# EAGLE design Crumb_Adapter_V1.2 (EAGLE 6.2)
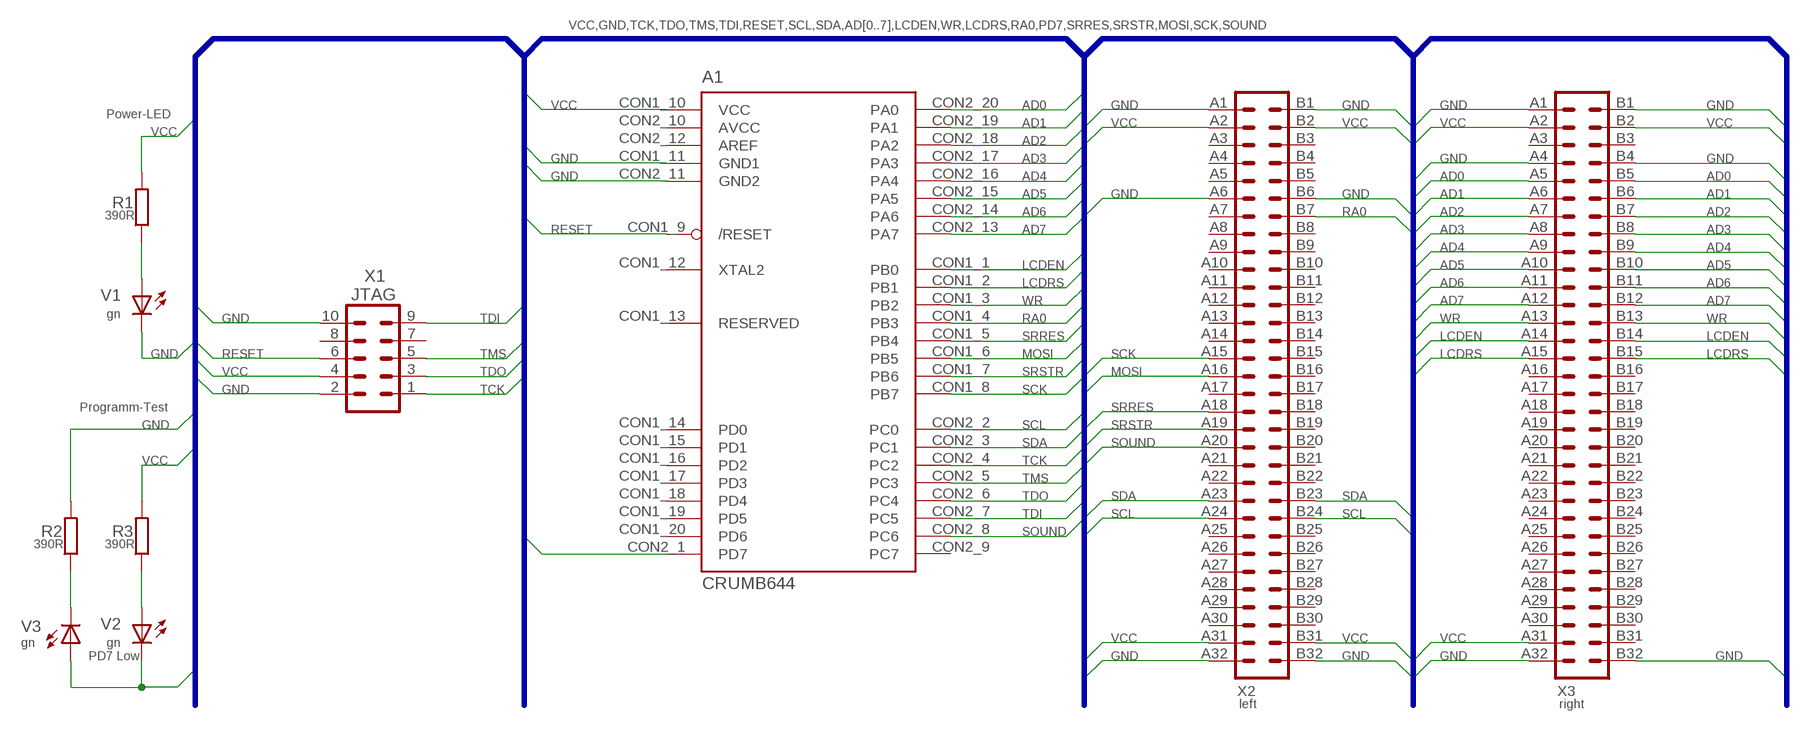
[diagram p0: schematic, sheet 1]

## Parts
A1  CRUMB644  [CRUMB644]
R1  390R  R-EU_VM1206  [M1206]
R2  390R  R-EU_VM1206  [M1206]
R3  390R  R-EU_VM1206  [M1206]
V1  gn  LEDCHIPLED_1206  [CHIPLED_1206]
V2  gn  LEDCHIPLED_1206  [CHIPLED_1206]
V3  gn  LEDCHIPLED_1206  [CHIPLED_1206]
X1  JTAG  MA05-2  [MA05-2]
X2  left  MAB64  [MAB32-2]
X3  right  MAB64  [MAB32-2]

## Nets
AD0: A1.CON2_20(PA0) X3.A5 X3.B5
AD1: A1.CON2_19(PA1) X3.A6 X3.B6
AD2: A1.CON2_18(PA2) X3.A7 X3.B7
AD3: A1.CON2_17(PA3) X3.A8 X3.B8
AD4: A1.CON2_16(PA4) X3.A9 X3.B9
AD5: A1.CON2_15(PA5) X3.A10 X3.B10
AD6: A1.CON2_14(PA6) X3.A11 X3.B11
AD7: A1.CON2_13(PA7) X3.A12 X3.B12
GND: A1.CON1_11(GND1) A1.CON2_11(GND2) R2.2 V1.C X1.2 X1.10 X2.A1 X2.A6 X2.A32 X2.B1 X2.B6 X2.B32 X3.A1 X3.A4 X3.A32 X3.B1 X3.B4 X3.B32
LCDEN: A1.CON1_1(PB0) X3.A14 X3.B14
LCDRS: A1.CON1_2(PB1) X3.A15 X3.B15
MOSI: A1.CON1_6(PB5) X2.A16
N$1: R1.1 V1.A
N$2: R3.1 V2.A
N$3: R2.1 V3.C
PD7: A1.CON2_1(PD7) V2.C V3.A
RA0: A1.CON1_4(PB3) X2.B7
RESET: A1.CON1_9(/RESET) X1.6
SCK: A1.CON1_8(PB7) X2.A15
SCL: A1.CON2_2(PC0) X2.A24 X2.B24
SDA: A1.CON2_3(PC1) X2.A23 X2.B23
SOUND: A1.CON2_8(PC6) X2.A20
SRRES: A1.CON1_5(PB4) X2.A18
SRSTR: A1.CON1_7(PB6) X2.A19
TCK: A1.CON2_4(PC2) X1.1
TDI: A1.CON2_7(PC5) X1.9
TDO: A1.CON2_6(PC4) X1.3
TMS: A1.CON2_5(PC3) X1.5
VCC: A1.CON1_10(VCC) R1.2 R3.2 X1.4 X2.A2 X2.A31 X2.B2 X2.B31 X3.A2 X3.A31 X3.B2
WR: A1.CON1_3(PB2) X3.A13 X3.B13
Unconnected: A1.CON1_12(XTAL2) A1.CON1_13(RESERVED) A1.CON1_14(PD0) A1.CON1_15(PD1) A1.CON1_16(PD2) A1.CON1_17(PD3) A1.CON1_18(PD4) A1.CON1_19(PD5) A1.CON1_20(PD6) A1.CON2_9(PC7) A1.CON2_10(AVCC) A1.CON2_12(AREF) X1.7 X1.8 X2.A3 X2.A4 X2.A5 X2.A7 X2.A8 X2.A9 X2.A10 X2.A11 X2.A12 X2.A13 X2.A14 X2.A17 X2.A21 X2.A22 X2.A25 X2.A26 X2.A27 X2.A28 X2.A29 X2.A30 X2.B3 X2.B4 X2.B5 X2.B8 X2.B9 X2.B10 X2.B11 X2.B12 X2.B13 X2.B14 X2.B15 X2.B16 X2.B17 X2.B18 X2.B19 X2.B20 X2.B21 X2.B22 X2.B25 X2.B26 X2.B27 X2.B28 X2.B29 X2.B30 X3.A3 X3.A16 X3.A17 X3.A18 X3.A19 X3.A20 X3.A21 X3.A22 X3.A23 X3.A24 X3.A25 X3.A26 X3.A27 X3.A28 X3.A29 X3.A30 X3.B3 X3.B16 X3.B17 X3.B18 X3.B19 X3.B20 X3.B21 X3.B22 X3.B23 X3.B24 X3.B25 X3.B26 X3.B27 X3.B28 X3.B29 X3.B30 X3.B31

## Buses
VCC,GND,TCK,TDO,TMS,TDI,RESET,SCL,SDA,AD[0..7],LCDEN,WR,LCDRS,RA0,PD7,SRRES,SRSTR,MOSI,SCK,SOUND

## Notes on the sheet
- Power-LED
- Programm-Test
- PD7 Low

## Library data of the parts
A1 = chip45_EagleLib_100521:CRUMB644: Crumb644 Crumb644 is a higly integrated rapid prototyping module with the ATmega644P AVR microcontroller by Atmel.; EEPROM: 4kB; FLASH: 64kB; PERIPHERALS: 2xUART, SPI, I2C, standard Atmel ISP 6-pin, CP2102 USB UART converter, RS285 SN75ALS176B transceiver; PROCESSOR: ATmega644P; RAM: 4kB SRAM
R1-R3 = MyRCL:R-EU_V: RESISTOR, European symbol
V1-V3 = MyDiode:LED: LED OSRAM: - CHIPLED LG R971, LG N971, LY N971, LG Q971, LY Q971, LO R971, LY R971 LH N974, LH R974 LS Q976, LO Q976, LY Q976 LO Q996 - Hyper CHIPLED LW Q18S LB Q993, LB Q99A, LB R99A - SideLED LS A670, LO A670, LY A670, LG A670, LP A670 LB A673, LV A673, LT A673, LW A673 LH A674 LY A675 LS A676, LA A676, LO A676, LY A676, LW A676 LS A679, LY A679, LG A679 - Hyper Micro SIDELED® LS Y876, LA Y876, LO Y876, LY Y876 LT Y87S - SmartLED LW L88C, LW L88S LB L89C, LB L89S, LG L890 LS L89K, LO L89K, LY L89K LS L896, LA L896, LO L896, LY L896 - TOPLED LS T670, LO T670, LY T670, LG T670, LP T670 LSG T670, LSP T670, LSY T670, LOP T670, LYG T670 LG T671, LOG T671, LSG T671 LB T673, LV T673, LT T673, LW T673 LH T674 LS T676, LA T676, LO T676, LY T676, LB T676, LH T676, LSB T676, LW T676 LB T67C, LV T67C, LT T67C, LS T67K, LO T67K, LY T67K, LW E67C LS E67B, LA E67B, LO E67B, LY E67B, LB E67C, LV E67C, LT E67C LW T67C LS T679, LY T679, LG T679 LS T770, LO T770, LY T770, LG T770, LP T770 LB T773, LV T773, LT T773, LW T773 LH T774 LS E675, LA E675, LY E675, LS T675 LS T776, LA T776, LO T776, LY T776, LB T776 LHGB T686 LT T68C, LB T68C - Hyper Mini TOPLED® LB M676 - Mini TOPLED Santana® LG M470 LS M47K, LO M47K, LY M47K Source: http://www.osram.convergy.de LUXEON: - LUMILED® LXK2-PW12-R00, LXK2-PW12-S00, LXK2-PW14-U00, LXK2-PW14-V00 LXK2-PM12-R00, LXK2-PM12-S00, LXK2-PM14-U00 LXK2-PE12-Q00, LXK2-PE12-R00, LXK2-PE12-S00, LXK2-PE14-T00, LXK2-PE14-U00 LXK2-PB12-K00, LXK2-PB12-L00, LXK2-PB12-M00, LXK2-PB14-N00, LXK2-PB14-P00, LXK2-PB14-Q00 LXK2-PR12-L00, LXK2-PR12-M00, LXK2-PR14-Q00, LXK2-PR14-R00 LXK2-PD12-Q00, LXK2-PD12-R00, LXK2-PD12-S00 LXK2-PH12-R00, LXK2-PH12-S00 LXK2-PL12-P00, LXK2-PL12-Q00, LXK2-PL12-R00 Source: www.luxeon.com KINGBRIGHT: KA-3528ASYC Source: www.kingbright.com
X1 = MyDivers:MA05-2: PIN HEADER; OC_FARNELL: unknown; OC_NEWARK: unknown
X2 X3 = MyDivers:MAB64

## Board
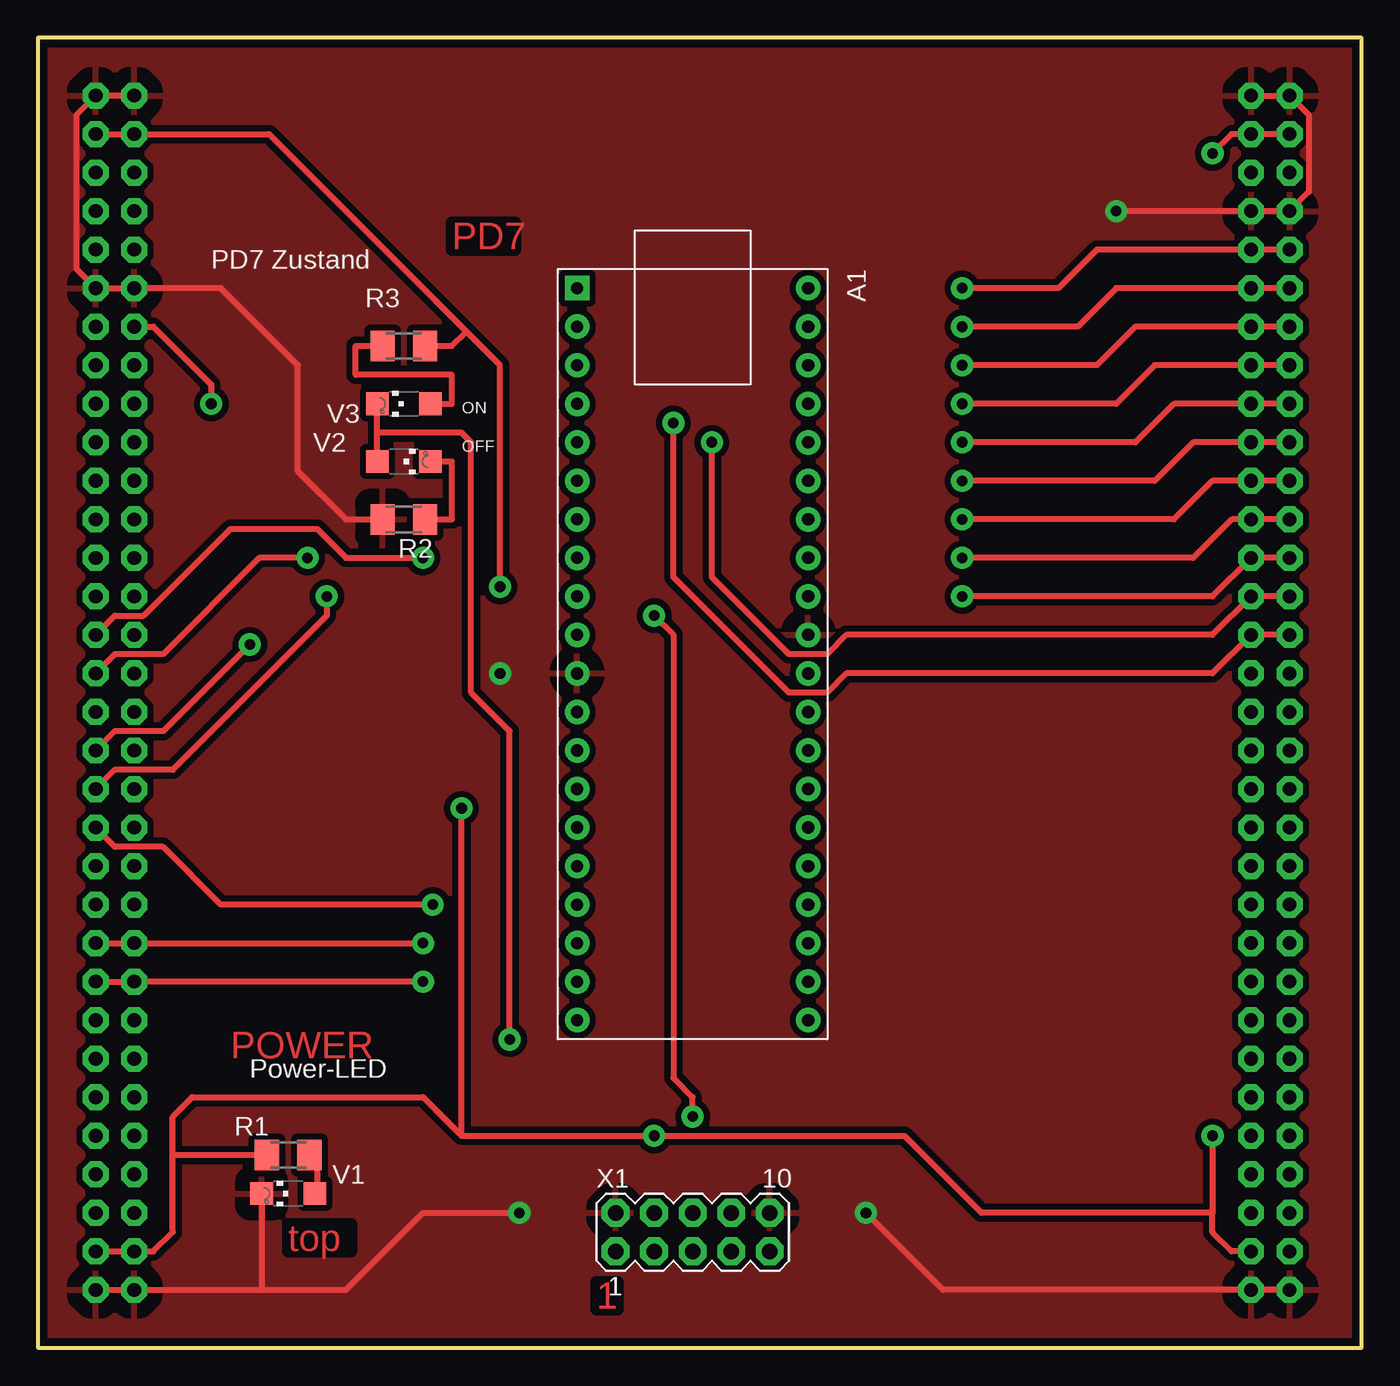
[diagram p1: board, top side]
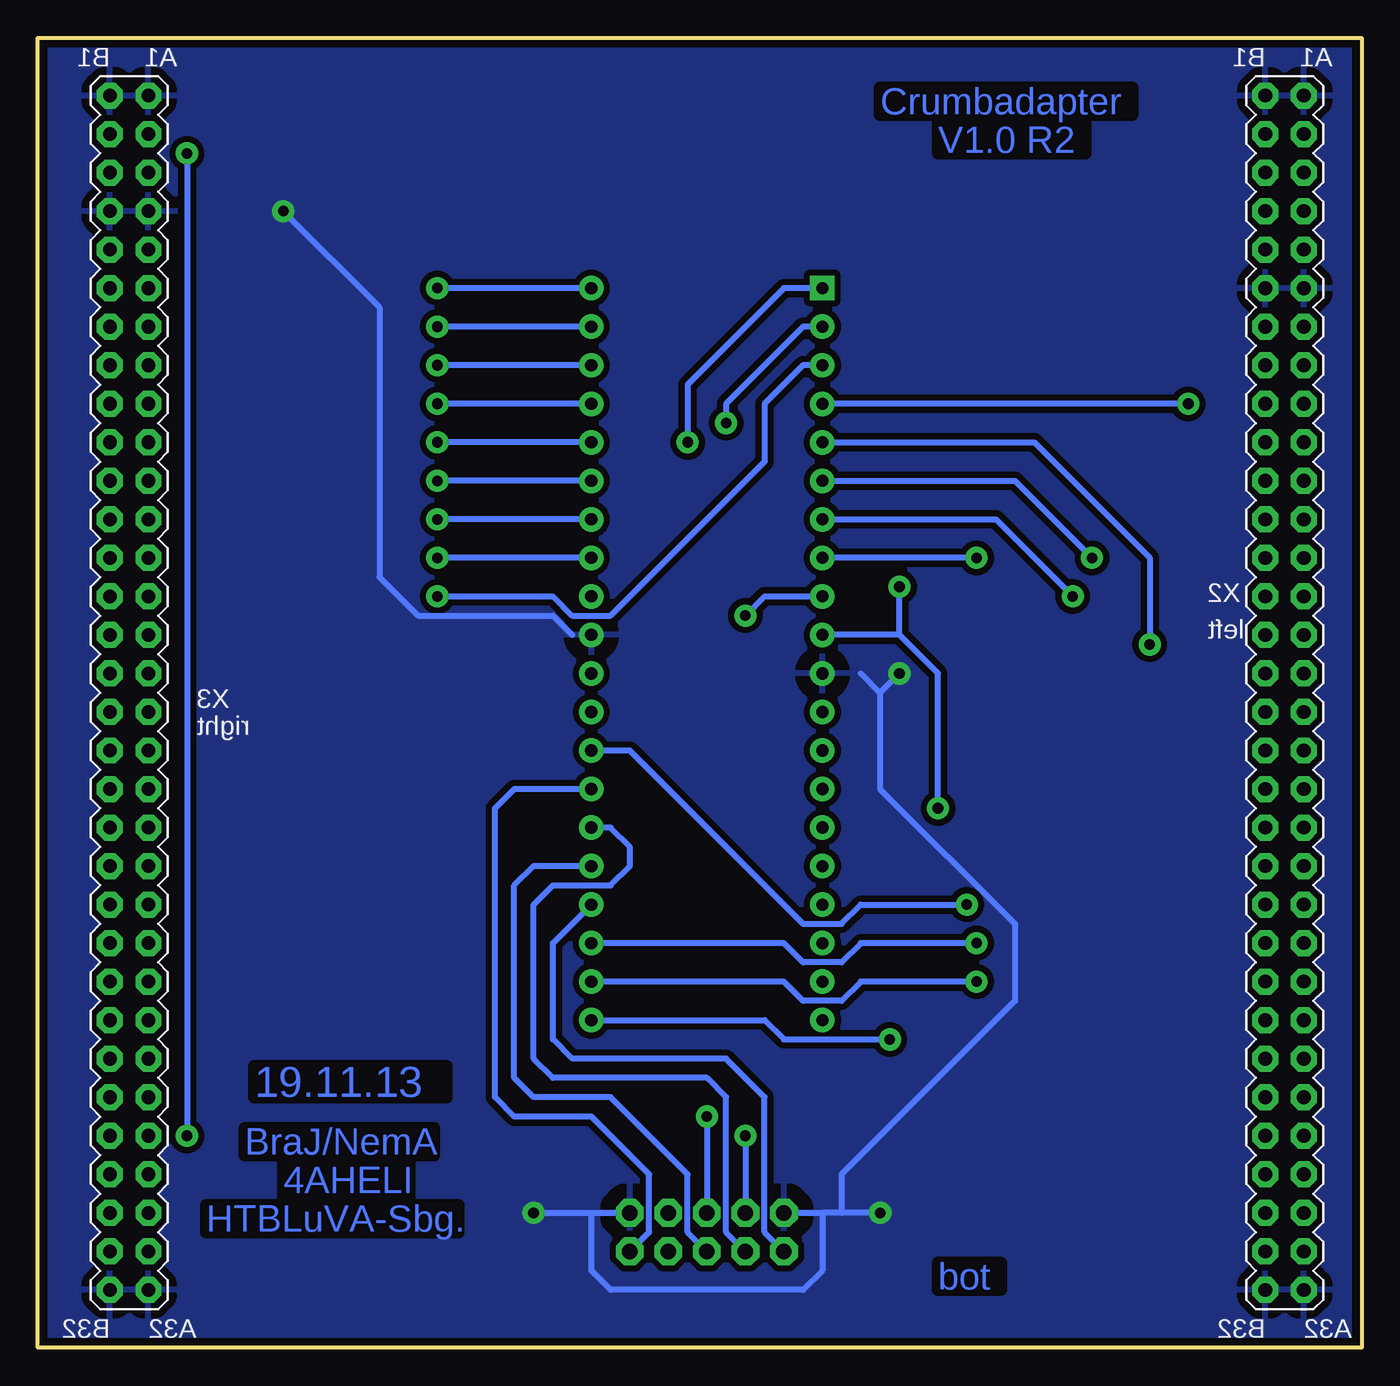
[diagram p2: board, bottom side, seen from below]

Size 87.3 x 86.35 mm. Coordinates in mm from the lower left corner, seen from the top.
Outline: 0,0 87.3,0 87.3,86.35 0,86.35 0,0
Copper layers (1+16): Top 0.035mm / dielectric 1.5mm / Bottom 0.035mm
Design rules: minimum track width 16mil, minimum drill 0.6mm, track to track 10mil, track to pad 8mil, pad to pad 8mil, via to via 8mil, smd to smd 8mil, copper to edge 20mil, drill to drill 8mil, minimum pad ring 16mil, minimum via ring 15mil, stop-mask expansion 4mil, vias tented up to drill 0mil, thermal gap 40mil

### Footprints (pad centres in the part's own frame; a part is rotated, then mirrored left to right if it is on the bottom)
CRUMB644 = drill 0.8 square: CON1_1 -24.13,-7.62 | drill 0.8: CON1_2 -21.59,-7.62; CON1_3 -19.05,-7.62; CON1_4 -16.51,-7.62; CON1_5 -13.97,-7.62; CON1_6 -11.43,-7.62; CON1_7 -8.89,-7.62; CON1_8 -6.35,-7.62; CON1_9 -3.81,-7.62; CON1_10 -1.27,-7.62; CON1_11 1.27,-7.62; CON1_12 3.81,-7.62; CON1_13 6.35,-7.62; CON1_14 8.89,-7.62; CON1_15 11.43,-7.62; CON1_16 13.97,-7.62; CON1_17 16.51,-7.62; CON1_18 19.05,-7.62; CON1_19 21.59,-7.62; CON1_20 24.13,-7.62; CON2_1 24.13,7.62; CON2_2 21.59,7.62; CON2_3 19.05,7.62; CON2_4 16.51,7.62; CON2_5 13.97,7.62; CON2_6 11.43,7.62; CON2_7 8.89,7.62; CON2_8 6.35,7.62; CON2_9 3.81,7.62; CON2_10 1.27,7.62; CON2_11 -1.27,7.62; CON2_12 -3.81,7.62; CON2_13 -6.35,7.62; CON2_14 -8.89,7.62; CON2_15 -11.43,7.62; CON2_16 -13.97,7.62; CON2_17 -16.51,7.62; CON2_18 -19.05,7.62; CON2_19 -21.59,7.62; CON2_20 -24.13,7.62
M1206 = smd 1.6 x 2: 1 -1.4,0; 2 1.4,0
CHIPLED_1206 = smd 1.5 x 1.5: A 0,-1.75; C 0,1.75
MA05-2 = drill 1.016 octagon: 1 -5.08,-1.27; 2 -5.08,1.27; 3 -2.54,-1.27; 4 -2.54,1.27; 5 0,-1.27; 6 0,1.27; 7 2.54,-1.27; 8 2.54,1.27; 9 5.08,-1.27; 10 5.08,1.27
MAB32-2 = drill 0.9 octagon: A1 1.27,39.37; A2 1.27,36.83; A3 1.27,34.29; A4 1.27,31.75; A5 1.27,29.21; A6 1.27,26.67; A7 1.27,24.13; A8 1.27,21.59; A9 1.27,19.05; A10 1.27,16.51; A11 1.27,13.97; A12 1.27,11.43; A13 1.27,8.89; A14 1.27,6.35; A15 1.27,3.81; A16 1.27,1.27; A17 1.27,-1.27; A18 1.27,-3.81; A19 1.27,-6.35; A20 1.27,-8.89; A21 1.27,-11.43; A22 1.27,-13.97; A23 1.27,-16.51; A24 1.27,-19.05; A25 1.27,-21.59; A26 1.27,-24.13; A27 1.27,-26.67; A28 1.27,-29.21; A29 1.27,-31.75; A30 1.27,-34.29; A31 1.27,-36.83; A32 1.27,-39.37; B1 -1.27,39.37; B2 -1.27,36.83; B3 -1.27,34.29; B4 -1.27,31.75; B5 -1.27,29.21; B6 -1.27,26.67; B7 -1.27,24.13; B8 -1.27,21.59; B9 -1.27,19.05; B10 -1.27,16.51; B11 -1.27,13.97; B12 -1.27,11.43; B13 -1.27,8.89; B14 -1.27,6.35; B15 -1.27,3.81; B16 -1.27,1.27; B17 -1.27,-1.27; B18 -1.27,-3.81; B19 -1.27,-6.35; B20 -1.27,-8.89; B21 -1.27,-11.43; B22 -1.27,-13.97; B23 -1.27,-16.51; B24 -1.27,-19.05; B25 -1.27,-21.59; B26 -1.27,-24.13; B27 -1.27,-26.67; B28 -1.27,-29.21; B29 -1.27,-31.75; B30 -1.27,-34.29; B31 -1.27,-36.83; B32 -1.27,-39.37

### Placement (x,y rotation side)
A1  43.18,45.72 270 top
DRILEGEND  [DRILEGEND]  17.31,-12.7 0 top  (outside the outline)
MEASURE  [MEASURE]  0,0 0 top
R1  16.51,12.7 180 top
R2  24.13,54.61 180 top
R3  24.13,66.04 0 top
V1  16.51,10.16 90 top
V2  24.13,62.23 90 top
V3  24.13,58.42 270 top
X1  43.18,7.62 0 top
X2  5.08,43.18 0 bottom
X3  81.28,43.18 0 bottom

### Tracks (layer width: path | path; a pad name or v marks a point on that pad's centre or on a via)
AD0  (via drill 0.7)
  Top 0.406: X3.B5 X3.A5 69.85,72.39 67.31,69.85 v60.96,69.85
  Bottom 0.406: A1.CON2_20 v60.96,69.85
AD1  (via drill 0.7)
  Top 0.406: X3.B6 X3.A6 71.12,69.85 68.58,67.31 v60.96,67.31
  Bottom 0.406: A1.CON2_19 v60.96,67.31
AD2  (via drill 0.7)
  Top 0.406: X3.B7 X3.A7 72.39,67.31 69.85,64.77 v60.96,64.77
  Bottom 0.406: A1.CON2_18 v60.96,64.77
AD3  (via drill 0.7)
  Top 0.406: X3.B8 X3.A8 73.66,64.77 71.12,62.23 v60.96,62.23
  Bottom 0.406: A1.CON2_17 v60.96,62.23
AD4  (via drill 0.7)
  Top 0.406: X3.B9 X3.A9 74.93,62.23 72.39,59.69 v60.96,59.69
  Bottom 0.406: A1.CON2_16 v60.96,59.69
AD5  (via drill 0.7)
  Top 0.406: X3.B10 X3.A10 76.2,59.69 73.66,57.15 v60.96,57.15
  Bottom 0.406: A1.CON2_15 v60.96,57.15
AD6  (via drill 0.7)
  Top 0.406: X3.B11 X3.A11 77.47,57.15 74.93,54.61 v60.96,54.61
  Bottom 0.406: A1.CON2_14 v60.96,54.61
AD7  (via drill 0.7)
  Top 0.406: X3.B12 X3.A12 78.74,54.61 76.2,52.07 v60.96,52.07
  Bottom 0.406: A1.CON2_13 v60.96,52.07
GND  (via drill 0.7)
  Top 0.406: X2.A32 X2.B32 14.61,3.81 | 14.61,3.81 20.32,3.81 25.4,8.89 v31.75,8.89 | X3.A1 X3.B1 83.82,81.28 83.82,76.2 X3.B4 X3.A4 v71.12,74.93 | X3.B32 X3.A32 59.69,3.81 v54.61,8.89 | X2.B1 X2.A1 2.54,81.28 2.54,71.12 X2.A6 X2.B6 12.06,69.85 17.14,64.77 17.14,57.78 20.32,54.61 R2.2 | V1.C 14.76,3.96 14.61,3.81
  Bottom 0.406: 34.29,8.89 35.56,8.89 | 33.02,44.45 31.75,43.18 | 31.75,43.18 31.75,36.83 22.86,27.94 22.86,22.86 34.29,11.43 34.29,8.89 | v71.12,74.93 64.77,68.58 64.77,50.8 62.23,48.26 53.34,48.26 52.07,46.99 | 50.8,8.89 X1.10 | X1.2 35.56,8.89 | 35.56,8.89 35.56,5.08 36.83,3.81 49.53,3.81 50.8,5.08 50.8,8.89 | v30.48,44.45 31.75,43.18 | v54.61,8.89 50.8,8.89 | v31.75,8.89 34.29,8.89
  pour Bottom (isolate 0.406): 0,86.36 87.63,86.36 87.63,0 -0.64,0 -0.64,85.72
  pour Top (isolate 0.406): 0,86.36 87.63,86.36 87.63,0 0,0
LCDEN  (via drill 0.7)
  Top 0.406: X3.B14 X3.A14 77.47,46.99 53.34,46.99 52.07,45.72 49.53,45.72 44.45,50.8 v44.45,59.69
  Bottom 0.406: A1.CON1_1 38.1,69.85 44.45,63.5 v44.45,59.69
LCDRS  (via drill 0.7)
  Top 0.406: X3.B15 X3.A15 77.47,44.45 53.34,44.45 52.07,43.18 49.53,43.18 41.91,50.8 v41.91,60.96
  Bottom 0.406: A1.CON1_2 36.83,67.31 41.91,62.23 v41.91,60.96
MOSI  (via drill 0.7)
  Top 0.406: v17.78,52.07 14.61,52.07 8.26,45.72 5.08,45.72 X2.A16
  Bottom 0.406: A1.CON1_6 22.86,57.15 v17.78,52.07
N$1
  Top 0.406: R1.1 17.91,12.57 18.41,12.06 18.41,10.31 V1.A
N$2
  Top 0.406: V2.A 27.3,62.23 27.3,64.14 20.95,64.14 20.95,66.04 R3.1
N$3
  Top 0.406: R2.1 27.3,54.61 27.3,58.42 V3.C
PD7  (via drill 0.7)
  Top 0.406: V3.A 22.38,60.33 | 22.38,60.33 V2.C | v31.11,20.32 31.11,40.64 28.57,43.18 28.57,59.69 27.94,60.33 22.38,60.33
  Bottom 0.406: A1.CON2_1 39.37,21.59 38.1,20.32 v31.11,20.32
RA0  (via drill 0.7)
  Top 0.406: X2.B7 7.62,67.31 11.43,63.5 v11.43,62.23
  Bottom 0.406: v11.43,62.23 A1.CON1_4
RESET  (via drill 0.7)
  Top 0.406: v40.64,48.26 41.91,46.99 41.91,17.78 43.18,16.51 v43.18,15.24
  Bottom 0.406: v43.18,15.24 X1.6 | v40.64,48.26 39.37,49.53 A1.CON1_9
SCK  (via drill 0.7)
  Top 0.406: X2.A15 5.08,48.26 6.99,48.26 12.7,53.98 18.41,53.98 20.32,52.07 v25.4,52.07
  Bottom 0.406: v25.4,52.07 A1.CON1_8
SCL  (via drill 0.7)
  Top 0.406: X2.A24 X2.B24 v25.4,24.13
  Bottom 0.406: v25.4,24.13 33.02,24.13 34.29,22.86 36.83,22.86 38.1,24.13 A1.CON2_2
SDA  (via drill 0.7)
  Top 0.406: X2.A23 X2.B23 v25.4,26.67
  Bottom 0.406: v25.4,26.67 33.02,26.67 34.29,25.4 36.83,25.4 38.1,26.67 A1.CON2_3
SOUND  (via drill 0.7)
  Top 0.406: v26.04,29.21 12.06,29.21 8.26,33.02 5.08,33.02 X2.A20
  Bottom 0.406: v26.04,29.21 33.02,29.21 34.29,27.94 36.83,27.94 48.26,39.37 A1.CON2_8
SRRES  (via drill 0.7)
  Top 0.406: v13.97,46.35 8.26,40.64 5.08,40.64 X2.A18
  Bottom 0.406: A1.CON1_5 21.59,59.69 13.97,52.07 v13.97,46.35
SRSTR  (via drill 0.7)
  Top 0.406: v19.05,49.53 19.05,48.26 8.89,38.1 5.08,38.1 X2.A19
  Bottom 0.406: A1.CON1_7 24.13,54.61 v19.05,49.53
TCK
  Bottom 0.406: X1.1 39.37,7.62 39.37,16.51 41.91,19.05 52.07,19.05 53.34,20.32 53.34,26.67 A1.CON2_4
TDI
  Bottom 0.406: X1.9 46.99,7.62 46.99,11.43 50.8,15.24 55.88,15.24 57.15,16.51 57.15,35.56 55.88,36.83 A1.CON2_7
TDO
  Bottom 0.406: X1.3 41.91,7.62 41.91,16.51 43.18,17.78 53.34,17.78 54.61,19.05 54.61,29.21 53.34,30.48 49.53,30.48 48.26,31.75 48.26,33.02 49.53,34.29 A1.CON2_6
TMS
  Bottom 0.406: X1.5 44.45,7.62 44.45,11.43 49.53,16.51 54.61,16.51 55.88,17.78 55.88,30.48 54.61,31.75 A1.CON2_5
VCC  (via drill 0.7)
  Top 0.406: X2.A31 X2.B31 7.62,6.35 8.89,7.62 8.89,12.7 | 27.94,13.97 v27.94,35.56 | X3.B2 X3.A2 78.74,80.01 v77.47,78.74 | 77.47,8.89 62.23,8.89 57.15,13.97 v40.64,13.97 27.94,13.97 | X2.A2 X2.B2 15.24,80.01 28.26,66.99 | 28.26,66.99 30.48,64.77 v30.48,50.16 | v77.47,13.97 77.47,8.89 | R3.2 27.3,66.04 28.26,66.99 | 8.89,12.7 8.89,15.24 10.16,16.51 25.4,16.51 27.94,13.97 | R1.2 8.89,12.7 | X3.A31 78.74,6.35 77.47,7.62 77.47,8.89
  Bottom 0.406: 30.48,46.99 27.94,44.45 v27.94,35.56 | 30.48,46.99 A1.CON1_10 | v77.47,78.74 v77.47,13.97 | v40.64,13.97 X1.4 | 30.48,46.99 v30.48,50.16
WR  (via drill 0.7)
  Top 0.406: X3.B13 X3.A13 77.47,49.53 v60.96,49.53
  Bottom 0.406: v60.96,49.53 53.34,49.53 52.07,48.26 49.53,48.26 39.37,58.42 39.37,62.23 36.83,64.77 A1.CON1_3

### Text on the board
Top: PD7 | POWER | top | 1
Bottom: Crumbadapter | V1.0 R2 | 19.11.13 | BraJ/NemA | 4AHELI | HTBLuVA-Sbg. | bot
tNames: PD7 Zustand | ON | OFF | Power-LED
_tsilk: PD7 Zustand | A1 | R3 | 390R | gn | ON | V3 | V2 | OFF | gn | R2 | 390R | CRUMB644 | Crumb644 | Power-LED | R1 | 390R | V1 | gn | X1 | 10 | 1 | JTAG
_bsilk: A1 | B1 | A1 | B1 | X2 | left | X3 | right | A32 | B32 | A32 | B32